# Altium schematic sheet dds.SchDoc
size A4
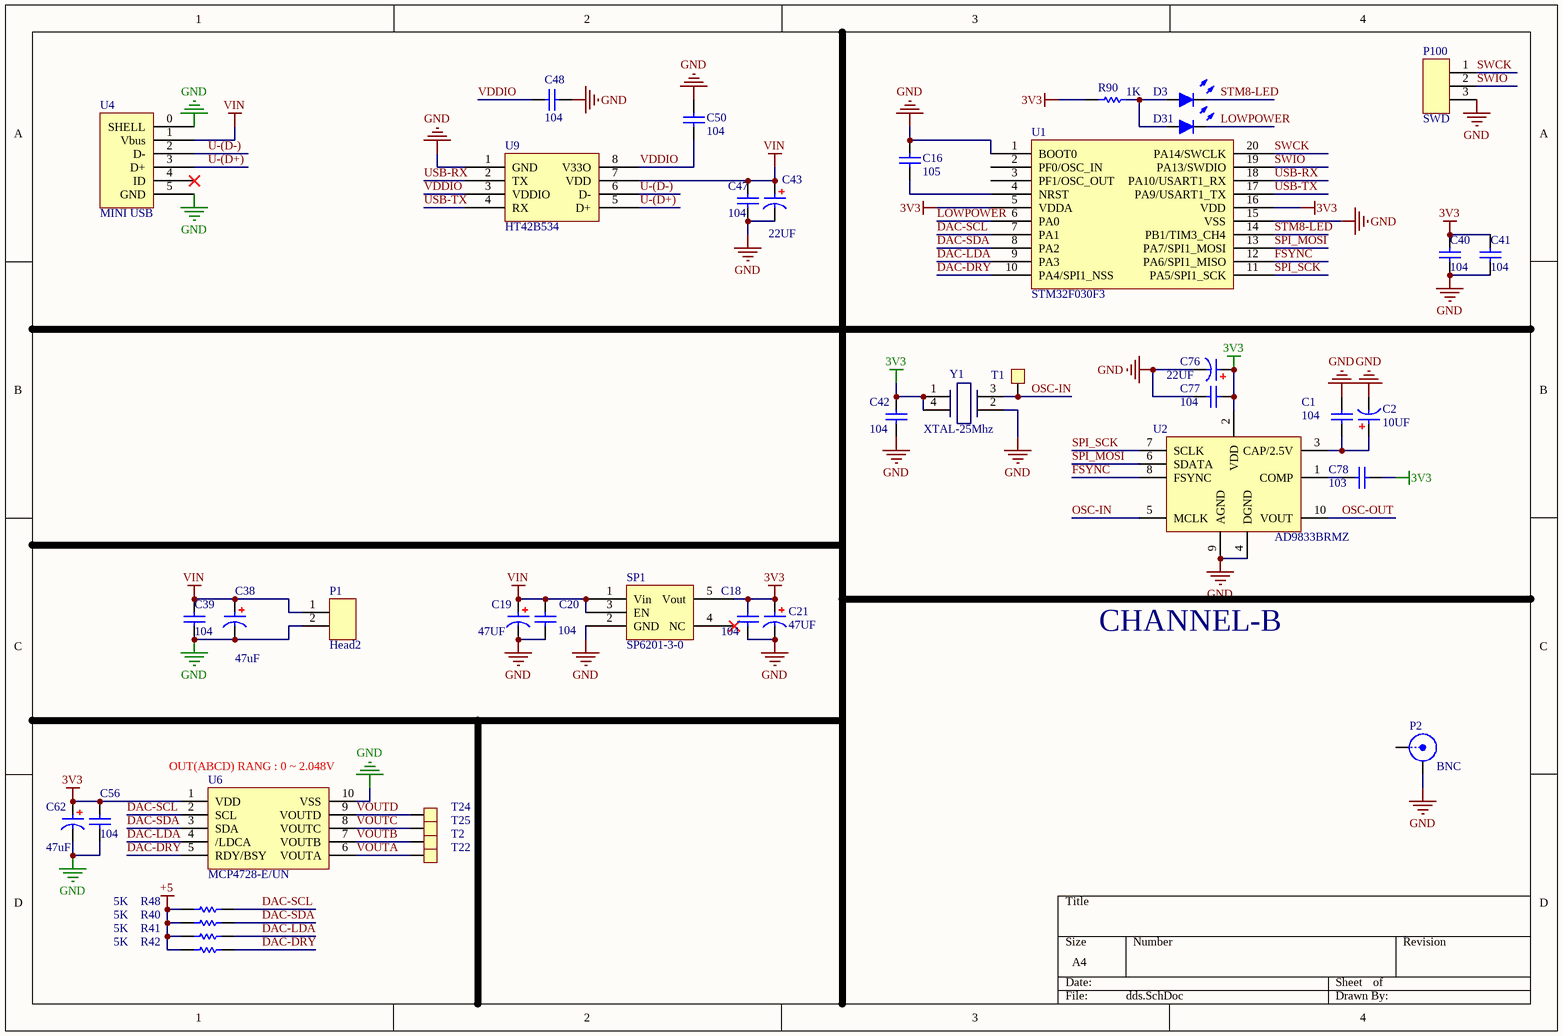
[diagram p0: dds.SchDoc]

## Parts
C1  C104  [0402]  (value not drawn)
C2  10UF  [0603C]
C16  C1uF  [0603C]  (value not drawn)
C18  C104  [0402]  (value not drawn)
C19  47UF  [CAP-T-3216]
C20  C104  [0402]  (value not drawn)
C21  47UF  [CAP-T-3216]
C38  47uF  [CAP-T-3216]
C39  C0.1uF  [0402]  (value not drawn)
C40  C0.1uF  [0402]  (value not drawn)
C41  C0.1uF  [0402]  (value not drawn)
C42  C0.1uF  [0402]  (value not drawn)
C43  22UF  [0603C]
C47  104  [0402]
C48  104  [0402]
C50  104  [0402]
C56  C0.1uF  [0402]  (value not drawn)
C62  47uF  [CAP-T-3216]
C76  22UF  [0603C]
C77  C104  [0402]  (value not drawn)
C78  C103  [0402]  (value not drawn)
D3  LED-G  [LED]  (value not drawn)
D31  LED-R  [LED]  (value not drawn)
P1  Head2  [HEAD2]
P2  BNC  [BNC-OSC]
P100  SWD  [head*3 - duplicate]
R40  R5K  [0402]  (value not drawn)
R41  R5K  [0402]  (value not drawn)
R42  R5K  [0402]  (value not drawn)
R48  R5K  [0402]  (value not drawn)
R90  R1K  [0603R]  (value not drawn)
SP1  SP6201-3-0  [SOT23-5]
T1  TP  [TEST_POINT]  (value not drawn)
T2  TP  [TEST_POINT]  (value not drawn)
T22  TP  [TEST_POINT]  (value not drawn)
T24  TP  [TEST_POINT]  (value not drawn)
T25  TP  [TEST_POINT]  (value not drawn)
U1  STM32F030F3  [TSSOP20]
U2  AD9833BRMZ  [MSOP10]
U4  MINI USB  [Micro_USB_t]
U6  MCP4728-E/UN  [MSOP10]
U9  HT42B534  [SOP-8]
Y1  XTAL-25Mhz  [XTAL3225]

## Nets
3V3: C18.1 C21.1 C40.1 C41.1 C42.2 C56.1 C62.1 C76.1 C77.1 C78.1 R90.1 SP1.5(Vout) U1.5(VDDA) U1.16(VDD) U2.2(VDD) U6.1(VDD) Y1.1 Y1.4
+5: R40.1 R41.1 R42.1 R48.2
GND: C1.2 C2.2 C16.1 C18.2 C19.2 C20.2 C21.2 C38.2 C39.2 C40.2 C41.2 C42.1 C43.2 C47.2 C48.2 C50.2 C56.2 C62.2 C76.2 C77.2 P1.2 P2.2(Y) P100.3 SP1.2(GND) U1.1(BOOT0) U1.15(VSS) U2.4(DGND) U2.9(AGND) U4.0(SHELL) U4.5(GND) U6.10(VSS) U9.1(GND) Y1.2
VIN: C19.1 C20.1 C38.1 C39.1 C43.1 C47.1 P1.1 SP1.1(Vin) SP1.3(EN) U4.1(Vbus) U9.7(VDD)
DAC-DRY: R42.2 U1.10(PA4/SPI1_NSS) U6.5(RDY/BSY)
DAC-LDA: R41.2 U1.9(PA3) U6.4(/LDCA)
DAC-SCL: R48.1 U1.7(PA1) U6.2(SCL)
DAC-SDA: R40.2 U1.8(PA2) U6.3(SDA)
FSYNC: U1.12(PA6/SPI1_MISO) U2.8(FSYNC)
LOWPOWER: D31.2(K) U1.6(PA0)
OSC-IN: T1.1(R) U2.5(MCLK) Y1.3
OSC-OUT: U2.10(VOUT)
SPI_MOSI: U1.13(PA7/SPI1_MOSI) U2.6(SDATA)
SPI_SCK: U1.11(PA5/SPI1_SCK) U2.7(SCLK)
STM8-LED: D3.2(K) U1.14(PB1/TIM3_CH4)
SWCK: P100.1 U1.20(PA14/SWCLK)
SWIO: P100.2 U1.19(PA13/SWDIO)
U-(D+): U4.3(D+) U9.5(D+)
U-(D-): U4.2(D-) U9.6(D-)
USB-RX: U1.18(PA10/USART1_RX) U9.2(TX)
USB-TX: U1.17(PA9/USART1_TX) U9.4(RX)
VDDIO: C48.1 C50.1 U9.3(VDDIO) U9.8(V33O)
VOUTA: T22.1(R) U6.6(VOUTA)
VOUTB: T2.1(R) U6.7(VOUTB)
VOUTC: T25.1(R) U6.8(VOUTC)
VOUTD: T24.1(R) U6.9(VOUTD)
NetC1_1: C1.1 C2.1 U2.3(CAP/2.5V)
NetC16_2: C16.2 U1.4(NRST)
NetC78_2: C78.2 U2.1(COMP)
NetD3_1: D3.1(A) D31.1(A) R90.2

Not connected (* = marked no-connect by the designer): P2 1(X); SP1 4(NC)*; U1 2(PF0/OSC_IN) 3(PF1/OSC_OUT); U4 4(ID)*

## Notes on the sheet
- CHANNEL-B
- (near U6) OUT(ABCD) RANG : 0 ~ 2.048V
- (in symbol C0.1uF) 104; 105; 103
- (in symbol R1K) 1K
- (in symbol R10K) 5K

## Library data of the parts
C1 C18 C20 C77 C78 = C0.1uF: 贴片电容
C2 C19 C21 C38 C62 C76 = C10uF: 贴片电容
C16 C47 C48 C50 = C0.1uF
C43 = C100uF
D3 D31 = LED
P2 = BNC: BNC Elbow Connector; LatestRevisionDate: 17-Jul-2002; LatestRevisionNote: Re-released for DXP Platform.; Publisher: Altium Limited
P100 = head*3
R40-R42 R48 = R10K
SP1 = SP6201
U1 = STM32F030F4
U2 = AD9833: price: 3.5
Y1 = XTAL-100Mhz